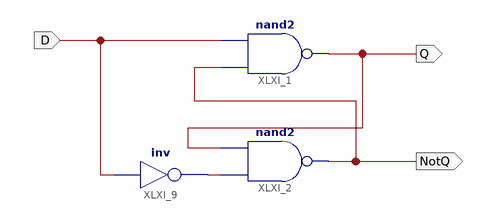
[diagram p0: schematic sheet 1]
// Xilinx ISE schematic D_latch_NoCtrl.sch (kintex7) as structural Verilog: 3 symbols, 3 ports
module D_latch_NoCtrl (
  input  D,
  output Q,
  output NotQ
);

  wire XLXN_11;

  nand XLXI_1 (Q, NotQ, D);
  nand XLXI_2 (NotQ, XLXN_11, Q);
  not XLXI_9 (XLXN_11, D);
endmodule
